# Altium schematic sheet DIP2350 RC0.SchDoc
size C; SheetNumber: 1; SheetTotal: 1
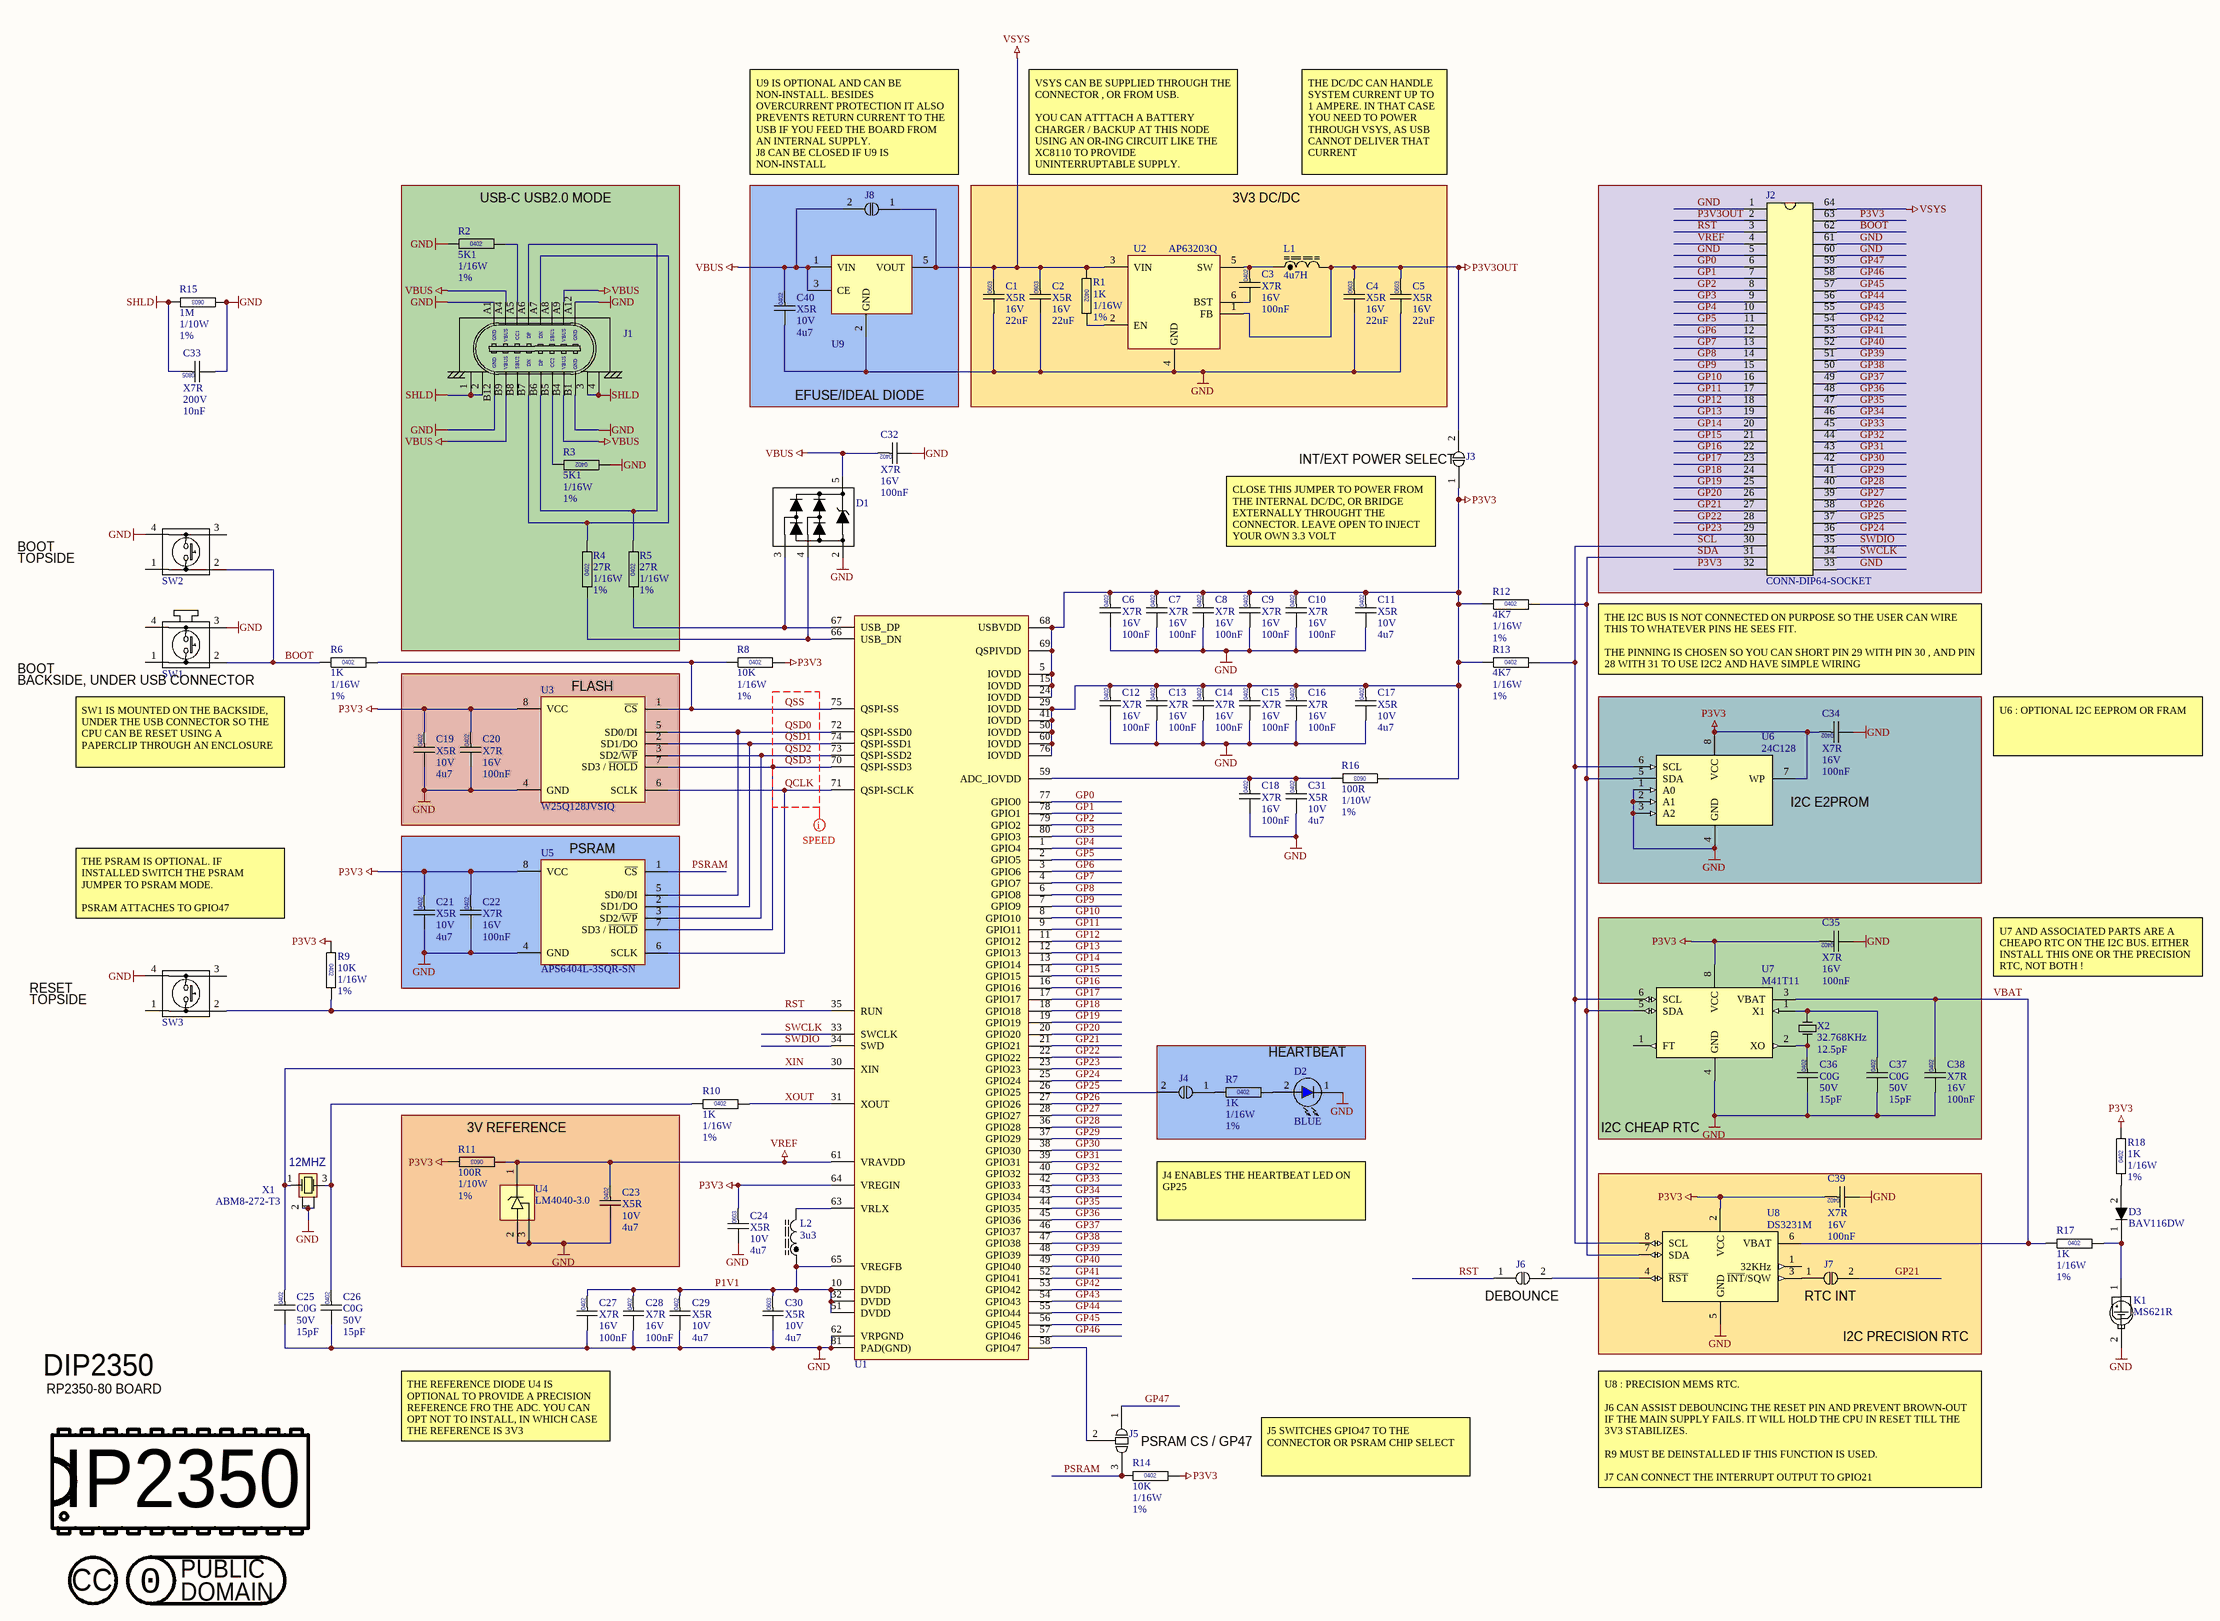
[diagram p0: DIP2350 RC0.SchDoc]

## Parts
C1  Dielectric: X5R  Voltage: 16V  Capacitance: 22uF  [CAPC0603]  (hidden comment: CAP0603)
C2  Dielectric: X5R  Voltage: 16V  Capacitance: 22uF  [CAPC0603]  (hidden comment: CAP0603)
C3  Dielectric: X7R  Voltage: 16V  Capacitance: 100nF  [CAPC0402]  (hidden comment: CAP0402)
C4  Dielectric: X5R  Voltage: 16V  Capacitance: 22uF  [CAPC0603]  (hidden comment: CAP0603)
C5  Dielectric: X5R  Voltage: 16V  Capacitance: 22uF  [CAPC0603]  (hidden comment: CAP0603)
C6  Dielectric: X7R  Voltage: 16V  Capacitance: 100nF  [CAPC0402]  (hidden comment: CAP0402)
C7  Dielectric: X7R  Voltage: 16V  Capacitance: 100nF  [CAPC0402]  (hidden comment: CAP0402)
C8  Dielectric: X7R  Voltage: 16V  Capacitance: 100nF  [CAPC0402]  (hidden comment: CAP0402)
C9  Dielectric: X7R  Voltage: 16V  Capacitance: 100nF  [CAPC0402]  (hidden comment: CAP0402)
C10  Dielectric: X7R  Voltage: 16V  Capacitance: 100nF  [CAPC0402]  (hidden comment: CAP0402)
C11  Dielectric: X5R  Voltage: 10V  Capacitance: 4u7  [CAPC0402]  (hidden comment: CAP0402)
C12  Dielectric: X7R  Voltage: 16V  Capacitance: 100nF  [CAPC0402]  (hidden comment: CAP0402)
C13  Dielectric: X7R  Voltage: 16V  Capacitance: 100nF  [CAPC0402]  (hidden comment: CAP0402)
C14  Dielectric: X7R  Voltage: 16V  Capacitance: 100nF  [CAPC0402]  (hidden comment: CAP0402)
C15  Dielectric: X7R  Voltage: 16V  Capacitance: 100nF  [CAPC0402]  (hidden comment: CAP0402)
C16  Dielectric: X7R  Voltage: 16V  Capacitance: 100nF  [CAPC0402]  (hidden comment: CAP0402)
C17  Dielectric: X5R  Voltage: 10V  Capacitance: 4u7  [CAPC0402]  (hidden comment: CAP0402)
C18  Dielectric: X7R  Voltage: 16V  Capacitance: 100nF  [CAPC0402]  (hidden comment: CAP0402)
C19  Dielectric: X5R  Voltage: 10V  Capacitance: 4u7  [CAPC0402]  (hidden comment: CAP0402)
C20  Dielectric: X7R  Voltage: 16V  Capacitance: 100nF  [CAPC0402]  (hidden comment: CAP0402)
C21  Dielectric: X5R  Voltage: 10V  Capacitance: 4u7  [CAPC0402]  (hidden comment: CAP0402)
C22  Dielectric: X7R  Voltage: 16V  Capacitance: 100nF  [CAPC0402]  (hidden comment: CAP0402)
C23  Dielectric: X5R  Voltage: 10V  Capacitance: 4u7  [CAPC0402]  (hidden comment: CAP0402)
C24  Dielectric: X5R  Voltage: 10V  Capacitance: 4u7  [CAPC0603]  (hidden comment: CAP0603)
C25  Dielectric: C0G  Voltage: 50V  Capacitance: 15pF  [CAPC0402]  (hidden comment: CAP0603)
C26  Dielectric: C0G  Voltage: 50V  Capacitance: 15pF  [CAPC0402]  (hidden comment: CAP0603)
C27  Dielectric: X7R  Voltage: 16V  Capacitance: 100nF  [CAPC0402]  (hidden comment: CAP0402)
C28  Dielectric: X7R  Voltage: 16V  Capacitance: 100nF  [CAPC0402]  (hidden comment: CAP0402)
C29  Dielectric: X5R  Voltage: 10V  Capacitance: 4u7  [CAPC0402]  (hidden comment: CAP0402)
C30  Dielectric: X5R  Voltage: 10V  Capacitance: 4u7  [CAPC0603]  (hidden comment: CAP0603)
C31  Dielectric: X5R  Voltage: 10V  Capacitance: 4u7  [CAPC0402]  (hidden comment: CAP0402)
C32  Dielectric: X7R  Voltage: 16V  Capacitance: 100nF  [CAPC0402]  (hidden comment: CAP0402)
C33  Dielectric: X7R  Voltage: 200V  Capacitance: 10nF  [CAPC0805]  (hidden comment: CAP0805)
C34  Dielectric: X7R  Voltage: 16V  Capacitance: 100nF  [CAPC0402]  (hidden comment: CAP0402)
C35  Dielectric: X7R  Voltage: 16V  Capacitance: 100nF  [CAPC0402]  (hidden comment: CAP0402)
C36  Dielectric: C0G  Voltage: 50V  Capacitance: 15pF  [CAPC0402]  (hidden comment: CAP0603)
C37  Dielectric: C0G  Voltage: 50V  Capacitance: 15pF  [CAPC0402]  (hidden comment: CAP0603)
C38  Dielectric: X7R  Voltage: 16V  Capacitance: 100nF  [CAPC0402]  (hidden comment: CAP0402)
C39  Dielectric: X7R  Voltage: 16V  Capacitance: 100nF  [CAPC0402]  (hidden comment: CAP0402)
C40  Dielectric: X5R  Voltage: 10V  Capacitance: 4u7  [CAPC0402]  (hidden comment: CAP0402)
D1  TVS-WURTH-824011  [SOT23-5]  (value not drawn)
D2  BLUE  [LED-0603-BLUE]
D3  BAV116DW  [SOD323]
J1  CONN-USBC-USB2-HOR  [CONN-GCT-USB4085]  (value not drawn)
J2  CONN-DIP64-SOCKET  [CONN-DIP64-SOCKET]  (no BOM)
J3  SOLDERPAD-2  [SOLDERPAD-2]  (value not drawn)  (no BOM)
J4  SOLDERPAD-2  [SOLDERPAD-2]  (value not drawn)  (no BOM)
J5  SOLDERPAD-3  [SOLDERPAD-3]  (value not drawn)  (no BOM)
J6  SOLDERPAD-2  [SOLDERPAD-2]  (value not drawn)  (no BOM)
J7  SOLDERPAD-2  [SOLDERPAD-2]  (value not drawn)  (no BOM)
J8  SOLDERPAD-2  [SOLDERPAD-2]  (value not drawn)  (no BOM)
K1  MS621R  [BAT-SEIKO-MS621R]
L1  value 4u7H  [IND-ABRACON-ASPI-3012S-3R9N-T]  (hidden comment: 4.7uH)
L2  value 3u3  [IND-ABRACON-B201610S3R3-101-T]  (hidden comment: AOTA-B201610S3R3-101-T)
LOGO1  LOGO-LICENSE-CC0-PUBLIC  [LOGO-LICENSE-CC0-PUBLIC]  (value not drawn)  (no BOM)
LOGO2  LOGO-LICENSE-CC  [LOGO-LICENSE-CC]  (value not drawn)  (no BOM)
R1  value 1K  Power: 1/16W  Tolerance: 1%  [RESC0402]  (hidden comment: RESC0402)
R2  value 5K1  Power: 1/16W  Tolerance: 1%  [RESC0402]  (hidden comment: RESC0402)
R3  value 5K1  Power: 1/16W  Tolerance: 1%  [RESC0402]  (hidden comment: RESC0402)
R4  value 27R  Power: 1/16W  Tolerance: 1%  [RESC0402]  (hidden comment: RESC0402)
R5  value 27R  Power: 1/16W  Tolerance: 1%  [RESC0402]  (hidden comment: RESC0402)
R6  value 1K  Power: 1/16W  Tolerance: 1%  [RESC0402]  (hidden comment: RESC0402)
R7  value 1K  Power: 1/16W  Tolerance: 1%  [RESC0402]  (hidden comment: RESC0402)
R8  value 10K  Power: 1/16W  Tolerance: 1%  [RESC0402]  (hidden comment: RESC0402)
R9  value 10K  Power: 1/16W  Tolerance: 1%  [RESC0402]  (hidden comment: RESC0402)
R10  value 1K  Power: 1/16W  Tolerance: 1%  [RESC0402]  (hidden comment: RESC0402)
R11  value 100R  Power: 1/10W  Tolerance: 1%  [RESC0603]  (hidden comment: RESC0603)
R12  value 4K7  Power: 1/16W  Tolerance: 1%  [RESC0402]  (hidden comment: RESC0402)
R13  value 4K7  Power: 1/16W  Tolerance: 1%  [RESC0402]  (hidden comment: RESC0402)
R14  value 10K  Power: 1/16W  Tolerance: 1%  [RESC0402]  (hidden comment: RESC0402)
R15  value 1M  Power: 1/10W  Tolerance: 1%  [RESC0603]  (hidden comment: RESC0603)
R16  value 100R  Power: 1/10W  Tolerance: 1%  [RESC0603]  (hidden comment: RESC0603)
R17  value 1K  Power: 1/16W  Tolerance: 1%  [RESC0402]  (hidden comment: RESC0402)
R18  value 1K  Power: 1/16W  Tolerance: 1%  [RESC0402]  (hidden comment: RESC0402)
SW1  SWITCH-E-SWITCH-TL1016  [SWITCH-ESWITCH-TL1016]  (value not drawn)
SW2  SWITCH-PANASONIC-EVP-AA202K  [SWITCH-PANASONIC-EVP-AA202K]  (value not drawn)
SW3  SWITCH-PANASONIC-EVP-AA202K  [SWITCH-PANASONIC-EVP-AA202K]  (value not drawn)
U1  IC-RP2350-DIP64  [QFN40P1000X1000X90_HS-81N]  (value not drawn)
U2  AP63203Q  [SOT23-6]
U3  W25Q128JVSIQ  [SO127P600-8N]
U4  LM4040-3.0  [SOT23]
U5  APS6404L-3SQR-SN  [SO127P600-8N]
U6  24C128  [SO127P600-8N]
U7  M41T11  [SO127P600-8N]
U8  DS3231M  [SO127P600-8N]
U9  XC8110  [SOT23-5]  (value not drawn)
X1  ABM8-272-T3  [XTAL-ABRACON-ABM8-272-T3]
X2  value 32.768KHz  LOAD: 12.5pF  [XTAL-3215]  (hidden comment: CRYSTAL-2PIN)

## Blocks framed on the sheet
USB-C USB2.0 MODE: J1 R2-R5
EFUSE/IDEAL DIODE: C40 J8 U9
3V3 DC/DC: C1-C5 L1 R1 U2
FLASH: C19 C20 U3
I2C E2PROM: C34 U6
PSRAM: C21 C22 U5
I2C CHEAP RTC: C35-C38 U7 X2
HEARTBEAT: D2 J4 R7
3V REFERENCE: C23 R11 U4

## Nets
GND: C1.2 C2.2 C4.2 C5.2 C6.2 C7.2 C8.2 C9.2 C10.2 C11.2 C12.2 C13.2 C14.2 C15.2 C16.2 C17.2 C18.2 C19.2 C20.2 C21.2 C22.2 C23.2 C24.2 C25.2 C26.2 C27.2 C28.2 C29.2 C30.2 C31.2 C32.2 C33.2 C34.2 C35.2 C36.2 C37.2 C38.2 C39.2 C40.2 D1.2(A) D2.1(A) J1.A1 J1.A12 J1.B1 J1.B12 J2.1 J2.5 J2.33 J2.60 J2.61 K1.2(-) R2.2 R3.2 R15.2 SW1.3 SW2.4 SW3.4 U1.62(VRPGND) U1.81(PAD(GND)) U2.4(GND) U3.4(GND) U4.2 U4.3 U5.4(GND) U6.1(A0) U6.2(A1) U6.3(A2) U6.4(GND) U7.4(GND) U8.5(GND) U9.2(GND) X1.2 X1.4
P3V3: C6.1 C7.1 C8.1 C9.1 C10.1 C11.1 C12.1 C13.1 C14.1 C15.1 C16.1 C17.1 C19.1 C20.1 C21.1 C22.1 C24.1 C34.1 C35.1 C39.1 J2.32 J2.63 J3.1 R8.2 R9.2 R11.2 R12.1 R13.1 R14.2 R16.1 R18.2 U1.5(IOVDD) U1.15(IOVDD) U1.24(IOVDD) U1.29(IOVDD) U1.41(IOVDD) U1.50(IOVDD) U1.60(IOVDD) U1.64(VREGIN) U1.68(USBVDD) U1.69(QSPIVDD) U1.76(IOVDD) U3.8(VCC) U5.8(VCC) U6.7(WP) U6.8(VCC) U7.8(VCC) U8.2(VCC)
P3V3OUT: C4.1 C5.1 J2.2 J3.2 L1.2 U2.1(FB)
SHLD: C33.1 J1.1 J1.2 J1.3 J1.4 R15.1
VBUS: C32.1 C40.1 D1.5(A) J1.A4 J1.A9 J1.B4 J1.B9 J8.2 U9.1(VIN) U9.3(CE)
VREF: C23.1 J2.4 R11.1 U1.61(VRAVDD) U4.1
VSYS: C1.1 C2.1 J2.64 J8.1 R1.2 U2.3(VIN) U9.5(VOUT)
BOOT: J2.62 R6.1 SW1.2 SW2.2
GP0: J2.6 U1.77(GPIO0)
GP1: J2.7 U1.78(GPIO1)
GP2: J2.8 U1.79(GPIO2)
GP3: J2.9 U1.80(GPIO3)
GP4: J2.10 U1.1(GPIO4)
GP5: J2.11 U1.2(GPIO5)
GP6: J2.12 U1.3(GPIO6)
GP7: J2.13 U1.4(GPIO7)
GP8: J2.14 U1.6(GPIO8)
GP9: J2.15 U1.7(GPIO9)
GP10: J2.16 U1.8(GPIO10)
GP11: J2.17 U1.9(GPIO11)
GP12: J2.18 U1.11(GPIO12)
GP13: J2.19 U1.12(GPIO13)
GP14: J2.20 U1.13(GPIO14)
GP15: J2.21 U1.14(GPIO15)
GP16: J2.22 U1.16(GPIO16)
GP17: J2.23 U1.17(GPIO17)
GP18: J2.24 U1.18(GPIO18)
GP19: J2.25 U1.19(GPIO19)
GP20: J2.26 U1.20(GPIO20)
GP21: J2.27 J7.2 U1.21(GPIO21)
GP22: J2.28 U1.22(GPIO22)
GP23: J2.29 U1.23(GPIO23)
GP24: J2.36 U1.25(GPIO24)
GP25: J2.37 J4.2 U1.26(GPIO25)
GP26: J2.38 U1.27(GPIO26)
GP27: J2.39 U1.28(GPIO27)
GP28: J2.40 U1.36(GPIO28)
GP29: J2.41 U1.37(GPIO29)
GP30: J2.42 U1.38(GPIO30)
GP31: J2.43 U1.39(GPIO31)
GP32: J2.44 U1.40(GPIO32)
GP33: J2.45 U1.42(GPIO33)
GP34: J2.46 U1.43(GPIO34)
GP35: J2.47 U1.44(GPIO35)
GP36: J2.48 U1.45(GPIO36)
GP37: J2.49 U1.46(GPIO37)
GP38: J2.50 U1.47(GPIO38)
GP39: J2.51 U1.48(GPIO39)
GP40: J2.52 U1.49(GPIO40)
GP41: J2.53 U1.52(GPIO41)
GP42: J2.54 U1.53(GPIO42)
GP43: J2.55 U1.54(GPIO43)
GP44: J2.56 U1.55(GPIO44)
GP45: J2.57 U1.56(GPIO45)
GP46: J2.58 U1.57(GPIO46)
GP47: J2.59 J5.1
P1V1: C27.1 C28.1 C29.1 C30.1 L2.1 U1.10(DVDD) U1.32(DVDD) U1.51(DVDD) U1.65(VREGFB)
PSRAM: J5.3 R14.1 U5.1(~{CS})
QCLK: U1.71(QSPI-SCLK) U3.6(SCLK) U5.6(SCLK)
QSD0: U1.72(QSPI-SSD0) U3.5(SD0/DI) U5.5(SD0/DI)
QSD1: U1.74(QSPI-SSD1) U3.2(SD1/DO) U5.2(SD1/DO)
QSD2: U1.73(QSPI-SSD2) U3.3(SD2/~{WP}) U5.3(SD2/~{WP})
QSD3: U1.70(QSPI-SSD3) U3.7(SD3_/_~{HOLD}) U5.7(SD3_/_~{HOLD})
QSS: R6.2 R8.1 U1.75(QSPI-SS) U3.1(~{CS})
RST: J2.3 J6.1 R9.1 SW3.2 U1.35(RUN)
SCL: J2.30 R13.2 U6.6(SCL) U7.6(SCL) U8.8(SCL)
SDA: J2.31 R12.2 U6.5(SDA) U7.5(SDA) U8.7(SDA)
SWCLK: J2.34 U1.33(SWCLK)
SWDIO: J2.35 U1.34(SWD)
VBAT: C38.1 R17.1 U7.3(VBAT) U8.6(VBAT)
XIN: C25.1 U1.30(XIN) X1.1
XOUT: R10.2 U1.31(XOUT)
NetC3_1: C3.1 L1.1 U2.5(SW)
NetC3_2: C3.2 U2.6(BST)
NetC18_1: C18.1 C31.1 R16.2 U1.59(ADC_IOVDD)
NetC26_1: C26.1 R10.1 X1.3
NetC36_1: C36.1 U7.2(XO) X2.2(OSC2)
NetC37_1: C37.1 U7.1(FT) X2.1(OSC1)
NetD1_3: D1.3(A) R5.2 U1.67(USB_DP)
NetD1_4: D1.4(A) R4.2 U1.66(USB_DN)
NetD2_2: D2.2(K) R7.2
NetD3_1: D3.1(K) K1.1(+) R17.2
NetD3_2: D3.2(A) R18.1
NetJ1_A5: J1.A5 R2.1
NetJ1_A6: J1.A6 J1.B6 R5.1
NetJ1_A7: J1.A7 J1.B7 R4.1
NetJ1_B5: J1.B5 R3.1
NetJ4_1: J4.1 R7.1
NetJ5_2: J5.2 U1.58(GPIO47)
NetJ6_2: J6.2 U8.4(~{RST})
NetJ7_1: J7.1 U8.3(~{INT}/SQW)
NetL2_2: L2.2 U1.63(VRLX)
NetR1_1: R1.1 U2.2(EN)

Not connected (* = marked no-connect by the designer): J1 A8 B8; SW1 1 4; SW2 1 3; SW3 1 3; U8 1(32KHz)

## Layout directives
net class QSPI; rule Matched Net Lengths [Delay Tolerance = 20ps]: QCLK, QSD0, QSD1, QSD2, QSD3, QSS

## Notes on the sheet
- (near J8) U9 IS OPTIONAL AND CAN BE NON-INSTALL. BESIDES OVERCURRENT PROTECTION IT ALSO PREVENTS RETURN CURRENT TO THE USB IF YOU FEED THE BOARD FROM AN INTERNAL SUPPLY.
  J8 CAN BE CLOSED IF U9 IS NON-INSTALL
- VSYS CAN BE SUPPLIED THROUGH THE CONNECTOR , OR FROM USB.
  YOU CAN ATTTACH A BATTERY CHARGER / BACKUP AT THIS NODE USING AN OR-ING CIRCUIT LIKE THE XC8110 TO PROVIDE UNINTERRUPTABLE SUPPLY.
- THE DC/DC CAN HANDLE SYSTEM CURRENT UP TO 1 AMPERE. IN THAT CASE YOU NEED TO POWER THROUGH VSYS, AS USB CANNOT DELIVER THAT CURRENT
- (near J3) INT/EXT POWER SELECT
- BOOT
- TOPSIDE
- (near J3) CLOSE THIS JUMPER TO POWER FROM THE INTERNAL DC/DC, OR BRIDGE EXTERNALLY THROUGHT THE CONNECTOR. LEAVE OPEN TO INJECT YOUR OWN 3.3 VOLT
- (near SW1) BACKSIDE, UNDER USB CONNECTOR
- (near J2) THE I2C BUS IS NOT CONNECTED ON PURPOSE SO THE USER CAN WIRE THIS TO WHATEVER PINS HE SEES FIT.
  THE PINNING IS CHOSEN SO YOU CAN SHORT PIN 29 WITH PIN 30 , AND PIN 28 WITH 31 TO USE I2C2 AND HAVE SIMPLE WIRING
- (near SW1) SW1 IS MOUNTED ON THE BACKSIDE, UNDER THE USB CONNECTOR SO THE CPU CAN BE RESET USING A PAPERCLIP THROUGH AN ENCLOSURE
- U6 : OPTIONAL I2C EEPROM OR FRAM
- THE PSRAM IS OPTIONAL. IF INSTALLED SWITCH THE PSRAM JUMPER TO PSRAM MODE.
  PSRAM ATTACHES TO GPIO47
- RESET
- U7 AND ASSOCIATED PARTS ARE A CHEAPO RTC ON THE I2C BUS. EITHER INSTALL THIS ONE OR THE PRECISION RTC, NOT BOTH !
- (near X1) 12MHZ
- J4 ENABLES THE HEARTBEAT LED ON GP25
- (near J6) DEBOUNCE
- (near J7) RTC INT
- DIP2350
- I2C PRECISION RTC
- RP2350-80 BOARD
- IP2350
- THE REFERENCE DIODE U4 IS OPTIONAL TO PROVIDE A PRECISION REFERENCE FRO THE ADC. YOU CAN OPT NOT TO INSTALL, IN WHICH CASE THE REFERENCE IS 3V3
- PSRAM CS / GP47
- J5 SWITCHES GPIO47 TO THE CONNECTOR OR PSRAM CHIP SELECT
- U8 : PRECISION MEMS RTC.
  J6 CAN ASSIST DEBOUNCING THE RESET PIN AND PREVENT BROWN-OUT IF THE MAIN SUPPLY FAILS. IT WILL HOLD THE CPU IN RESET TILL THE 3V3 STABILIZES.
  R9 MUST BE DEINSTALLED IF THIS FUNCTION IS USED.
  J7 CAN CONNECT THE INTERRUPT OUTPUT TO GPIO21
- (in symbol CAPC-0402-4u7-10V-X5R) 0402
- (in symbol CAPC-0805-10nF-200V-ESD) 0805
- (in symbol CONN-USBC-USB2-HOR) GND; VBUS; CC1; DP; DN; SBU1; SBU2; CC2
- (in symbol LOGO-LICENSE-CC) CC
- (in symbol LOGO-LICENSE-CC0-PUBLIC) PUBLIC; 0; DOMAIN
- (in symbol RESC-0402-1K-1%-1/10W) 0402
- (in symbol RESC-0402-4K7-1%-1/10W) 0402
- (in symbol RESC-0402-5K1-1%-1/10W) 0402
- (in symbol RESC-0402-10K-1%-1/10W) 0402
- (in symbol RESC-0402-27R-1%-1/10W) 0402
- (in symbol RESC-0603-1M-1%-1/10W) 0603
- (in symbol RESC-0603-100R-1%-1/10W) 0603

## Library data of the parts
C1 C2 C4 C5 = CAPC-0603-22uF-16V-X5R: CAPACITOR,CERAMIC,22uF,16V,X5R,0603; Package / Case: 0603; Location: *; Supplier 1: Digikey; Supplier Part Number 1: 1276-7076-1-ND; LCSC: C2762594
C3 C6-C10 C12-C16 C18 C20 C22 C27 C28 C32 C34 C35 C38 C39 = CAPC-0402-100nF-16V-X7R: CAPACITOR,CERAMIC,100nF,16V,X7R,0402; Package / Case: 0402; Location: *; Supplier 1: Digikey; Supplier Part Number 1: 1292-1630-1-ND; LCSC: C60474
C11 C17 C19 C21 C23 C29 C31 C40 = CAPC-0402-4u7-10V-X5R: CAPACITOR,CERAMIC,4u7,10V,X5R,0402; Package / Case: 0603; Location: *; Supplier 1: Digikey; Supplier Part Number 1: 1276-1482-1-ND; LCSC: C1705
C24 C30 = CAPC-0603-4u7-10V-X5R: CAPACITOR,CERAMIC,4u7,10V,X5R,0603; Package / Case: 0603; Location: *; Supplier 1: Arrow Electronics; Supplier Part Number 1: GRM188Z71A475KE15J; LCSC: C1705
C25 C26 C36 C37 = CAPC-0402-15PF-50V-C0G: CAPACITOR,CERAMIC,15pF,50V,C0G,0402; Package / Case: 0402; Location: *; Supplier 1: Digikey; Supplier Part Number 1: 311-3780-1-ND; LCSC: C3906764
C33 = CAPC-0805-10nF-200V-ESD: CAPACITOR,CERAMIC,10nF,200V,X7R,0805 (2012),ESD; Package / Case: 0805 (2012 metric); Location: *; LCSC: C36911368; Supplier 1: Mouser; Supplier Part Number 1: 80-C0805C103K2RECAUT
D1 = TVS-WURTH-824011: DIODE,TVS,DUAL,UNIDIRECTIONAL,USB; Supplier 1: Digikey; Supplier Part Number 1: 732-4465-1-ND; LCSC: C22358704
D2 = LED-WURTH-150060BS75000: LED,BLUE,0603; LCSC: C965807; Supplier 1: Digikey; Supplier Part Number 1: 732-4966-1-ND
D3 = DIODE-DIODES-BAV116WS: DIODE,75V,215mA,SOD323,LOW LEAKAGE; LCSC: C459842; Supplier 1: Arrow Electronics; Supplier Part Number 1: BAV116WS-7
J1 = CONN-USBC-USB2-HOR: CONN,USB-C,16P,RA,TH,8.94X9.17; Supplier 1: Digikey; Supplier Part Number 1: 2073-USB4085-GF-ACT-ND; LCSC: C36936564
K1 = BAT-SEIKO-MS621R: BAT,3V,SMD,SEIKO MS621R; Supplier 1: Digikey; Supplier Part Number 1: 36-1056-ND
L1 = IND-TAIYO-NRH3012T4R7MN: IND,4.7uH,1.06A,3X3, NRH3012T4R7MN; LCSC: C5159666, C42429096; Supplier 1: Digikey; Supplier Part Number 1: 587-2591-1-ND
L2 = IND-ABRACON-AOTA-B201610S3R3-101-T: IND,3U3,RP2350, ABRACON AOTA-B201610S3R3-101-T; Supplier 1: Mouser; Supplier Part Number 1: 815-AB201610S3R3101T; LCSC: C42411119
R1 R6 R7 R10 R17 R18 = RESC-0402-1K-1%-1/10W: RESISTOR,1K,1%,63mW,0402 (1005); Location: *; LCSC: C106235; Supplier 1: Future Electronics; Supplier Part Number 1: 7825607
R2 R3 = RESC-0402-5K1-1%-1/10W: RESISTOR,5K1,1%,63mW,0402 (1005); Location: *; LCSC: C105872; Supplier 1: Future Electronics; Supplier Part Number 1: 6053649
R4 R5 = RESC-0402-27R-1%-1/10W: RESISTOR,27R,1%,63mW,0402 (1005); Location: *; Supplier 1: Future Electronics; Supplier Part Number 1: 2577120; LCSC: C138021
R8 R9 R14 = RESC-0402-10K-1%-1/10W: RESISTOR,10K,1%,63mW,0402 (1005); Location: *; LCSC: C60490; Supplier 1: Future Electronics; Supplier Part Number 1: 3388022
R11 R16 = RESC-0603-100R-1%-1/10W: RESISTOR,100R,1%,100mW,0603 (1608); Location: *; LCSC: C105588; Supplier 1: Digikey; Supplier Part Number 1: 311-100HRCT-ND
R12 R13 = RESC-0402-4K7-1%-1/10W: RESISTOR,4K7,1%,63mW,0402 (1005); Location: *; LCSC: C105871; Supplier 1: Future Electronics; Supplier Part Number 1: 3795218
R15 = RESC-0603-1M-1%-1/10W: RESISTOR,1M,1%,100mW,0603 (1608); Location: *; Supplier 1: Future Electronics; Supplier Part Number 1: 2912863; Supplier 2: Mouser; Supplier Part Number 2: 667-ERJ-3EKF1004V; Supplier 3: Avnet; Supplier Part Number 3: 6-2176339-1; LCSC: C105578
SW1 = SWITCH-E-SWITCH-TL1016: SW,SMD,TACT,4PIN,2.9X3.5,4PIN,SIDE ACTUATOR; Supplier 1: Digikey; Supplier Part Number 1: 141-TL1016AAF160QGCT-ND; LCSC: C483790
SW2 SW3 = SWITCH-PANASONIC-EVP-AA202K: SW,SMD,TACT,4PIN,2.9X3.5,4PIN; Supplier 1: Mouser; Supplier Part Number 1: 667-EVP-AA202K; LCSC: C483888
U1 = IC-RP2350-DIP64: IC,CPU,RP2350B,QFN80; LCSC: C42415655
U2 = IC-DIODES-AP63203Q: IC,PMIC,STEP-DOWN, 2A 3.3V; Supplier 1: Digikey; Supplier Part Number 1: 31-AP63203QWU-7CT-ND; LCSC: C780769
U3 = IC-WINBOND-W25Q128JVSIQ: IC,FLASH,QSPI,16Mx8; Supplier 1: Digikey; Supplier Part Number 1: W25Q128JVSIQCT-ND; LCSC: C97521
U4 = IC-TI-LM4040-3: IC,VOLTAGE REFERENCE,3.0V; Supplier 1: Mouser; Supplier Part Number 1: 926-LM4040AIM330NOPB; LCSC: C460608
U5 = IC-APMEMORY-APS6404L-3SQR-SN: IC,PSRAM,QSPI,8Mx8,SO8; LCSC: C5333729; Supplier 1: Mouser; Supplier Part Number 1: 878-APS6404L-3SQR-SN
U6 = IC-GENERIC-24C128: IC,EEPROM,I2C, 128KBIT; Supplier 1: Arrow Electronics; Supplier Part Number 1: AT24C128C-SSHM-T; LCSC: C6478
U7 = IC-ST-M41T11: IC,RTC+RAM+VBAT,I2C 1101000,  SMHDDMY; Supplier 1: Arrow Electronics; Supplier Part Number 1: M41T11M6F; LCSC: C907713
U8 = IC-ANALOG-DS3231M: IC,RTC,I2C,DS3231M; Supplier 1: Mouser; Supplier Part Number 1: 700-DS3231MZ+TRL; LCSC: C107410
U9 = IC-TOREX-XC8110: IC,PMIC,IDEAL DIODE ORING CONTROLLER; LCSC: C3235547; Supplier 1: Digikey; Supplier Part Number 1: 893-XC8110AA01MR-GCT-ND
X1 = XTAL-ABRACON-ABM8-272-T3: XTAL,12MHZ,RP2350; Supplier 1: Mouser; Supplier Part Number 1: 815-ABM8-272-T3; LCSC: C20625731
X2 = XTAL-RALTRON-RT3215-32.768-12.5-TR-10PPM: XTAL,32.768KHz,12.5PF,3215; LCSC: C37635363; Supplier 1: Digikey; Supplier Part Number 1: 2151-RT3215-32.768-12.5-TR-10PPMCT-ND